# Altium schematic sheet Sheet6.SchDoc
size A; SheetNumber: 4; SheetTotal: 4
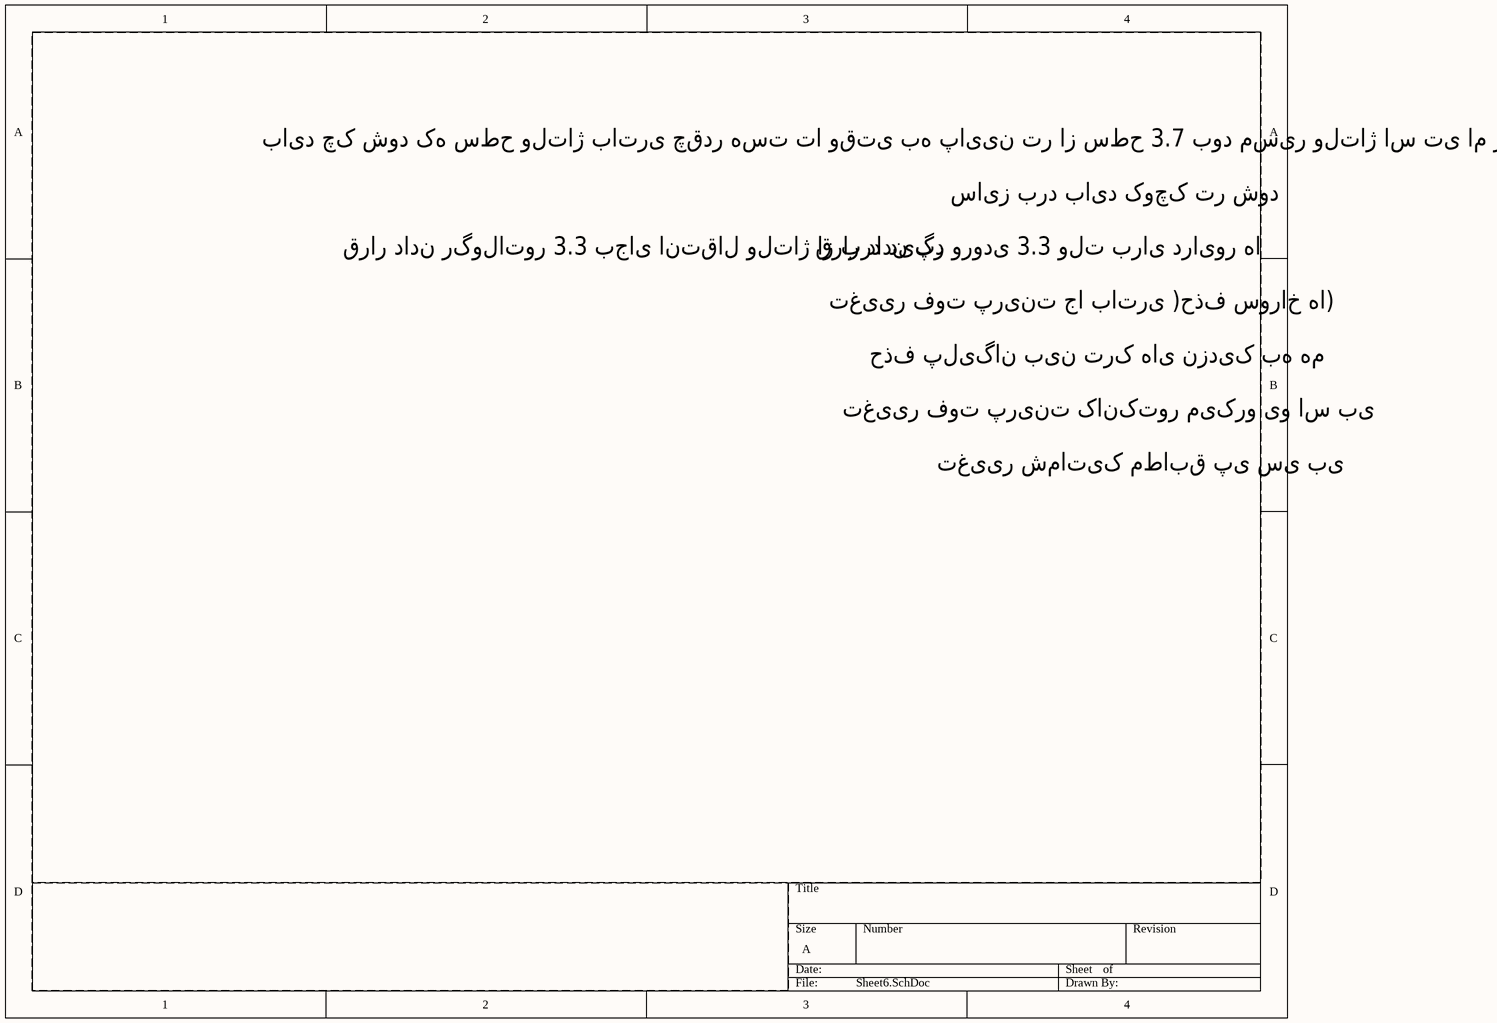
[diagram p0: Sheet6.SchDoc]

## Notes on the sheet
- باید چک شود که سطح ولتاژ باتری چقدر هست تا وقتی به پایین تر از سطح 3.7 بود مسیر ولتاژ اس تی ام رو قطع کند
- سایز برد باید کوچک تر شود
- قرار دادن رگولاتور 3.3 بجای انتقال ولتاژ از برد دیگر
- قرار دادن پد ورودی 3.3 ولت برای درایور ها
- تغییر فوت پرینت جا باتری )حذف سوراخ ها)
- حذف پلیگان بین ترک های نزدیک به هم
- تغییر فوت پرینت کانکتور میکرو یو اس بی
- تغییر شماتیک مطابق پی سی بی